# Altium schematic sheet 1v8_Regulator.SchDoc: 1.8V Regulator
size A4; Organization: Altium Limited; Address1: L3, 12a Rodborough Rd; Address2: Frenchs Forest; Address3: NSW; Address4: Australia 2086
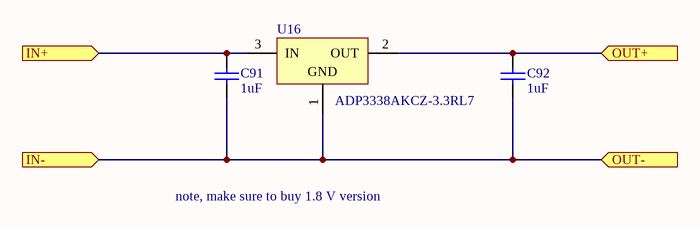
[diagram p0: 1v8_Regulator.SchDoc]

## Parts
C91  1uF  [0402_Cap]
C92  1uF  [0402_Cap]
U16  ADP3338AKCZ-3.3RL7  [ADI-KC-3_M]

## Ports
IN+ (in), IN- (in), OUT+ (in), OUT- (in)

## Nets
IN+: C91.2 U16.3(IN) ; port IN+
IN-: C91.1 C92.1 U16.1(GND) ; port OUT-, port IN-
OUT+: C92.2 U16.2(OUT) ; port OUT+

## Notes on the sheet
- note, make sure to buy 1.8 V version
- Title
- Date:
- RE:
- Arturo di Girolamo
- Size:
- A3
- A

## Library data of the parts
C91 C92 = CL21B105KBFNFNE: Capacitor, 1uF, 0805; Value: .01uf; ASYPN: CL05A105KQ5NNNC; MFGPN: CL21B105KBFNFNE
U16 = CMP-0786-00147-1: High Accuracy, Ultralow IQ, 1 A, anyCAP(R) Low Dropout Regulator, 2.7 to 8 V Vin, 3.3 V Vout, Industrial, 3-pin SOT223 (KC-3), Reel; Manufacturer: Analog Devices; Supply Current IGND @ Small Load: 110uA; Vin (min) (V): 2.7; Preset Vout Values (V): 3.3; Iout max: 1A; Vin (max) (V): 8; ASYPN: ADP3338AKCZ-1.8-R7; PackageDescription: 3-Pin Small Outline Transistor Package, Body 3.5 x 6.5 mm, Pitch 2.3 mm; Code_JEDEC: TO-261-AA; ComponentLink4Description: URL Link1; ComponentLink4URL: Product URL:http://www.analog.com/en/ADP3338/productSearch.html; PackageVersion: 11-20-2012-B, 11/2012; DatasheetVersion: Rev. B; ComponentLink3URL: http:/www.analog.com/static/imported-files/packages/PKG_PDF/SOT_223(KC)/KC_3.pdf; Mounting Technology: Surface Mount; ComponentLink2URL: http://www.analog.com/static/imported-files/data_sheets/ADP3338.pdf; PartNumber: ADP3338AKCZ-3.3RL7; ComponentLink2Description: Datasheet; ComponentLink3Description: Package Specification; ComponentLink1Description: Manufacturer URL; Packing: Reel; PackageReference: KC-3; ComponentLink1URL: http://www.analog.com/en/index.html